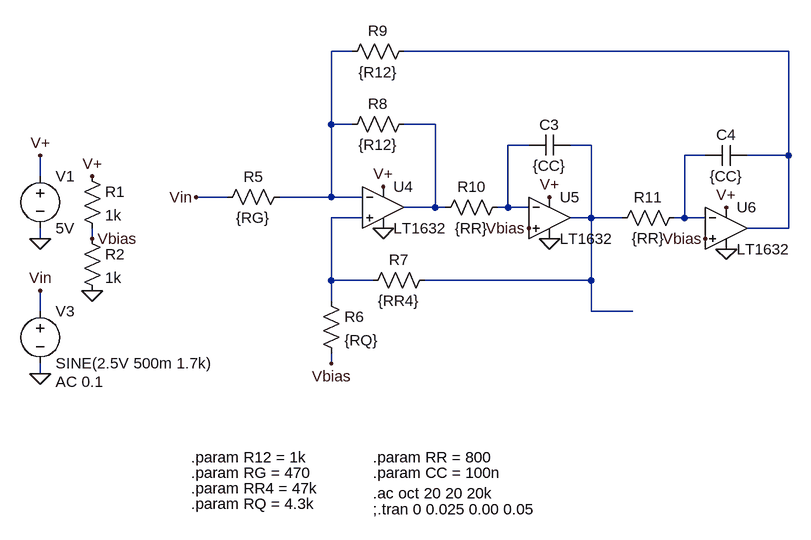
[diagram p0: schematic SimpleStateVar.asc]
SimpleStateVar.asc, the LTspice schematic file:
Version 4
SHEET 1 1880 680
WIRE 32 -240 0 -240
WIRE 704 -240 112 -240
WIRE 0 -128 0 -240
WIRE 32 -128 0 -128
WIRE 160 -128 112 -128
WIRE 304 -96 272 -96
WIRE 400 -96 368 -96
WIRE 576 -80 544 -80
WIRE 704 -80 704 -240
WIRE 704 -80 640 -80
WIRE -448 -48 -448 -80
WIRE -160 -16 -208 -16
WIRE 0 -16 0 -128
WIRE 0 -16 -80 -16
WIRE 48 -16 0 -16
WIRE 160 0 160 -128
WIRE 160 0 112 0
WIRE 176 0 160 0
WIRE 272 0 272 -96
WIRE 272 0 256 0
WIRE 304 0 272 0
WIRE 48 16 0 16
WIRE 400 16 400 -96
WIRE 400 16 368 16
WIRE 448 16 400 16
WIRE 544 16 544 -80
WIRE 544 16 528 16
WIRE 576 16 544 16
WIRE 704 32 704 -80
WIRE 704 32 640 32
WIRE -448 48 -448 32
WIRE -368 48 -368 32
WIRE 0 112 0 16
WIRE 64 112 0 112
WIRE 400 112 400 16
WIRE 400 112 144 112
WIRE 0 144 0 112
WIRE -448 160 -448 128
WIRE 400 160 400 112
WIRE 464 160 400 160
WIRE 0 240 0 224
WIRE -448 256 -448 240
FLAG -448 48 0
FLAG -448 256 0
FLAG -448 -80 V+
FLAG -448 128 Vin
FLAG 336 48 0
FLAG 80 32 0
FLAG 608 64 0
FLAG 608 0 V+
FLAG 336 -16 V+
FLAG 80 -32 V+
FLAG 304 32 Vbias
FLAG 576 48 Vbias
FLAG 0 240 Vbias
FLAG -208 -16 Vin
FLAG -368 128 0
FLAG -368 -48 V+
FLAG -368 48 Vbias
SYMBOL voltage -448 -64 R0
WINDOW 123 0 0 Left 0
WINDOW 39 0 0 Left 0
SYMATTR InstName V1
SYMATTR Value 5V
SYMBOL voltage -448 144 R0
WINDOW 123 24 124 Left 2
WINDOW 39 0 0 Left 0
SYMATTR Value2 AC 0.1
SYMATTR InstName V3
SYMATTR Value SINE(2.5V 500m 1.7k)
SYMBOL res -64 -32 R90
WINDOW 0 0 56 VBottom 2
WINDOW 3 32 56 VTop 2
SYMATTR InstName R5
SYMATTR Value {RG}
SYMBOL Opamps\\LT1632 80 -64 R0
SYMATTR InstName U4
SYMBOL res -16 128 R0
SYMATTR InstName R6
SYMATTR Value {RQ}
SYMBOL res 160 96 R90
WINDOW 0 0 56 VBottom 2
WINDOW 3 32 56 VTop 2
SYMATTR InstName R7
SYMATTR Value {RR4}
SYMBOL res 16 -224 R270
WINDOW 0 32 56 VTop 2
WINDOW 3 0 56 VBottom 2
SYMATTR InstName R9
SYMATTR Value {R12}
SYMBOL Opamps\\LT1632 336 -48 R0
SYMATTR InstName U5
SYMBOL res 272 -16 R90
WINDOW 0 0 56 VBottom 2
WINDOW 3 32 56 VTop 2
SYMATTR InstName R10
SYMATTR Value {RR}
SYMBOL res 128 -144 R90
WINDOW 0 0 56 VBottom 2
WINDOW 3 32 56 VTop 2
SYMATTR InstName R8
SYMATTR Value {R12}
SYMBOL cap 368 -112 R90
WINDOW 0 0 32 VBottom 2
WINDOW 3 32 32 VTop 2
SYMATTR InstName C3
SYMATTR Value {CC}
SYMBOL res 544 0 R90
WINDOW 0 0 56 VBottom 2
WINDOW 3 32 56 VTop 2
SYMATTR InstName R11
SYMATTR Value {RR}
SYMBOL Opamps\\LT1632 608 -32 R0
SYMATTR InstName U6
SYMBOL cap 576 -64 R270
WINDOW 0 32 32 VTop 2
WINDOW 3 0 32 VBottom 2
SYMATTR InstName C4
SYMATTR Value {CC}
SYMBOL res -384 -64 R0
SYMATTR InstName R1
SYMATTR Value 1k
SYMBOL res -384 32 R0
SYMATTR InstName R2
SYMATTR Value 1k
TEXT -216 384 Left 2 !.param R12 = 1k
TEXT -216 408 Left 2 !.param RG = 470
TEXT 64 384 Left 2 !.param RR = 800
TEXT 64 408 Left 2 !.param CC = 100n
TEXT 64 440 Left 2 !.ac oct 20 20 20k
TEXT 64 464 Left 2 !;.tran 0 0.025 0.00 0.05
TEXT -216 432 Left 2 !.param RR4 = 47k
TEXT -216 456 Left 2 !.param RQ = 4.3k

The netlist it stands for:
* SimpleStateVar.asc
V1 V+ 0 5V
V3 Vin 0 SINE(2.5V 500m 1.7k) AC 0.1
R5 N001 Vin {RG}
XU4 N007 N001 V+ 0 N003 LT1632  ; pins In+ In- V+ V- OUT
R6 N007 Vbias {RQ}
R7 N005 N007 {RR4}
R9 N001 N002 {R12}
XU5 Vbias N004 V+ 0 N005 LT1632  ; pins In+ In- V+ V- OUT
R10 N004 N003 {RR}
R8 N003 N001 {R12}
C3 N005 N004 {CC}
R11 N006 N005 {RR}
XU6 Vbias N006 V+ 0 N002 LT1632  ; pins In+ In- V+ V- OUT
C4 N006 N002 {CC}
R1 V+ Vbias 1k
R2 Vbias 0 1k
.param R12 = 1k
.param RG = 470
.param RR = 800
.param CC = 100n
.ac oct 20 20 20k
;.tran 0 0.025 0.00 0.05
.param RR4 = 47k
.param RQ = 4.3k
.lib LTC.lib
.backanno
.end